# Altium project DisposeIt_Project2.PrjPcb
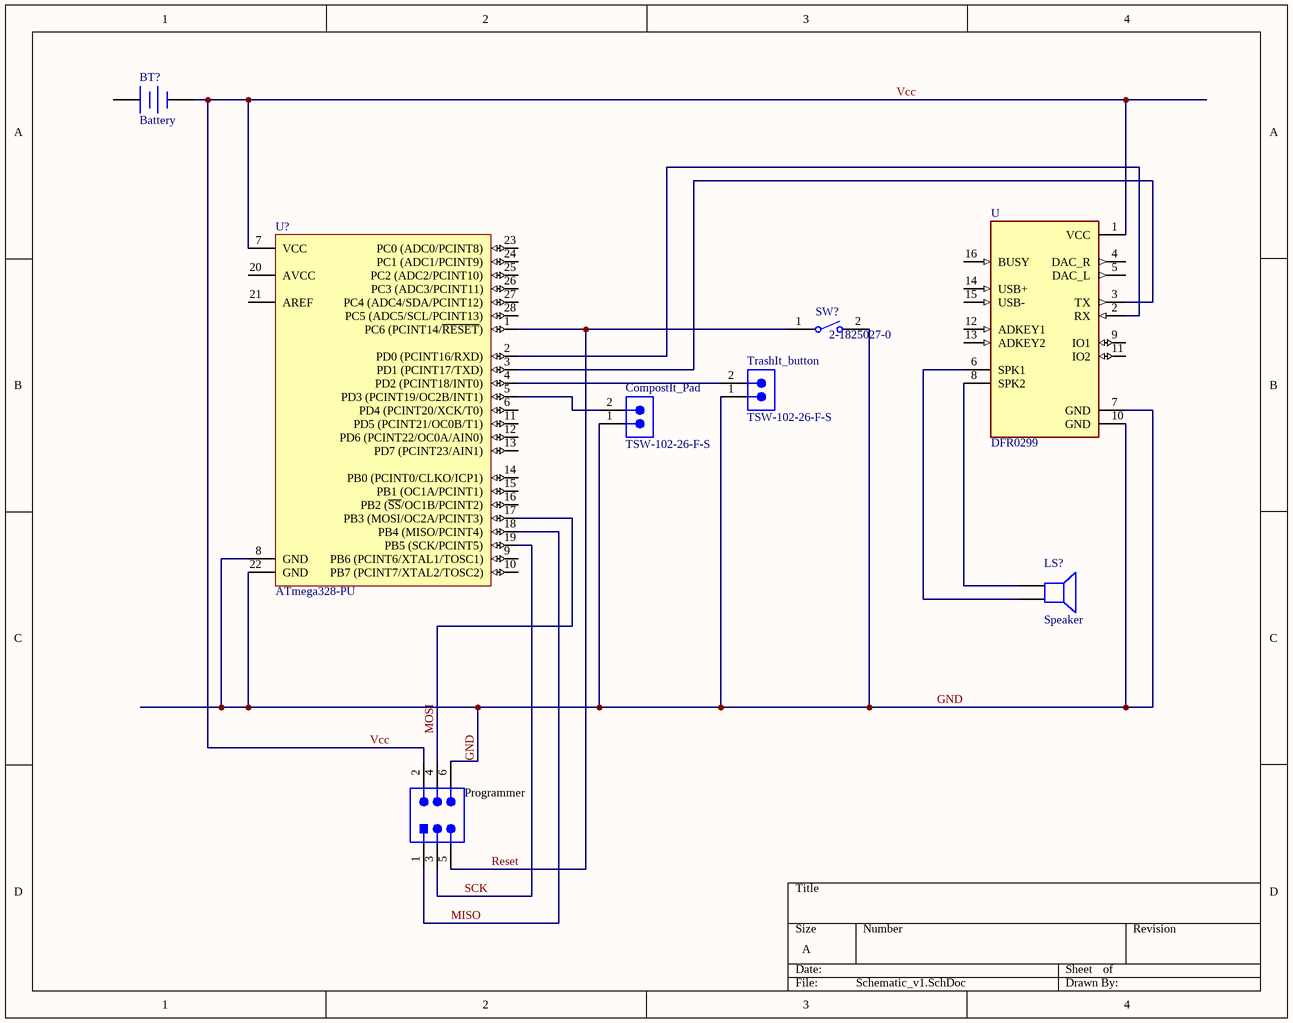
[diagram p0: Schematic_v1.SchDoc]
1 sheet, 8 parts. Net scope: global (net labels, ports and power ports of the same name join across sheets).

## Sheet Schematic_v1.SchDoc
size A; SheetNumber: 1; SheetTotal: 1

### Parts
BT?  Battery  [BAT-2]
CompostIt_Pad  TSW-102-26-F-S  [SMTC-TSW-102-26-XX-S]
LS?  Speaker  [PIN2]
Programmer  TSW-103-08-L-D  [SMTC-TSW-103-08-L-D_V]  (value not drawn)
SW?  2-1825027-0  [TECO-2-1825027-0_V]
TrashIt_button  TSW-102-26-F-S  [SMTC-TSW-102-26-XX-S]
U  DFR0299  [MODULE_DFR0299]
U?  ATmega328-PU  [28P3]

### Nets
GND: CompostIt_Pad.1 Programmer.6 SW?.2 TrashIt_button.1 U.7(GND) U.10(GND) U?.8(GND) U?.22(GND)
MISO: Programmer.1 U?.18(PB4_(MISO/PCINT4))
MOSI: Programmer.4 U?.17(PB3_(MOSI/OC2A/PCINT3))
Reset: Programmer.5 SW?.1 U?.1(PC6_(PCINT14/~{RESET}))
SCK: Programmer.3 U?.19(PB5_(SCK/PCINT5))
Vcc: BT?.2(-) Programmer.2 U.1(VCC) U?.7(VCC)
NetCompostIt_Pad_2: CompostIt_Pad.2 U?.5(PD3_(PCINT19/OC2B/INT1))
NetLS?_1: LS?.1 U.8(SPK2)
NetLS?_2: LS?.2 U.6(SPK1)
NetTrashIt_button_2: TrashIt_button.2 U?.4(PD2_(PCINT18/INT0))
NetU_2: U.2(RX) U?.2(PD0_(PCINT16/RXD))
NetU_3: U.3(TX) U?.3(PD1_(PCINT17/TXD))

Not connected (* = marked no-connect by the designer): BT? 1(+); U 4(DAC_R) 5(DAC_L) 9(IO1) 11(IO2) 12(ADKEY1) 13(ADKEY2) 14(USB+) 15(USB-) 16(BUSY); U? 6(PD4_(PCINT20/XCK/T0)) 9(PB6_(PCINT6/XTAL1/TOSC1)) 10(PB7_(PCINT7/XTAL2/TOSC2)) 11(PD5_(PCINT21/OC0B/T1)) 12(PD6_(PCINT22/OC0A/AIN0)) 13(PD7_(PCINT23/AIN1)) 14(PB0_(PCINT0/CLKO/ICP1)) 15(PB1_(OC1A/PCINT1)) 16(PB2_(~{SS}/OC1B/PCINT2)) 20(AVCC) 21(AREF) 23(PC0_(ADC0/PCINT8)) 24(PC1_(ADC1/PCINT9)) 25(PC2_(ADC2/PCINT10)) 26(PC3_(ADC3/PCINT11)) 27(PC4_(ADC4/SDA/PCINT12)) 28(PC5_(ADC5/SCL/PCINT13))

### Library data of the parts
BT? = Battery: Multicell Battery; Published: 24-Mar-1999; LatestRevisionDate: 17-Jul-2002; LatestRevisionNote: Re-released for DXP Platform.; PackageReference: BAT-2; Publisher: Altium Limited; PackageDescription: Battery; 2 Leads
CompostIt_Pad TrashIt_button = CMP-002-00072-1: .025'' SQ. TERMINAL STRIPS; Max Voltage Rating (AC): 550V; Contact Post Length: 3.2mm; Number of Positions: 2; Gender: Male; Max Current Rating: 7.6A; Pitch: 2.54mm; Voltage Rating: 500V; Packaging: Bulk; Package Quantity: 1; Length: 5.08mm; Max Operating Temperature: 125°C; Flammability Rating: UL94 V-0; Depth: 2.54mm; Radiation Hardening: No; Contact Type: -; Contact Mating Length: 5.84mm; Orientation: Vertical; Housing Color: Black; Series: TSW; Weight: 0.001257oz; Number of Rows: 1; Housing Material: Polyester; Contact Gender: Male; Termination: Through Hole; Contact Material: Bronze; Contact Plating: Gold; Number of Contacts: 2; REACH SVHC: No SVHC; RoHS Compliant: Yes; Min Operating Temperature: -55°C
LS? = Speaker: Loudspeaker; Published: 24-Mar-1999; LatestRevisionDate: 17-Jul-2002; LatestRevisionNote: Re-released for DXP Platform.; PackageReference: PIN2; Publisher: Altium Limited
Programmer = CMP-1024-00336-5: Male Header, Pitch 2.54 mm, 2 x 3 Position, Height 8.38 mm, Tail Length 5.08 mm, -55 to 125 degC, RoHS, Bulk; Manufacturer: Samtec; DatasheetVersion: 04/2012; ComponentLink3URL: http://suddendocs.samtec.com/prints/tsw-xxx-xx-x-x-xx-xxx-footprint.pdf; PackageReference: TSW-103-08-L-D; Mounting Technology: Through Hole; Min Operating Temperature: -55 degC; ComponentLink2Description: Datasheet; Lead Pitch: 2.54 mm; ComponentLink1Description: Manufacturer URL; Mount: Through Hole; ComponentLink1URL: http://www.samtec.com/; ComponentLink3Description: Package Specification; Max Operating Temperature: 125 degC; PackageDescription: Male Header, Pitch 2.54 mm, 2 x 3 Position, Height 8.38 mm, Tail Length 5.08 mm; ComponentLink2URL: https://datasheet.ciiva.com/25618/0900766b81154476-25618436.pdf; RoHSCompliant: true
SW? = CMP-2000-05529-1: Micro-Miniature Pushbutton Switch, 50 mA, -35 to 85 degC, 2-Pin THD, RoHS, Bulk; Manufacturer: TE Connectivity; Pole Throw Configuration: SPST; Body Orientation: RightAngle; Product Length (mm): 7.11mm; Voltage Rating (VDC): 24V; Current Rating (Max): 0.05A; Product Depth (mm): 10mm; Operating Force: 1.57N; Actuator Style: RoundButton; Illumination Type: NotRequired; Ground Terminal: No; Product Height (mm): 7.01mm; Actuator Color: Black; Switch Function Configuration: OFFON; Package Reference: 2-1825027-0; Terminal Type: PCPins; Contact Plating: Silver; Package Description: 2-Pin Through Hole Device, Body 15.86 x 7.11 mm, Pitch 4.5 mm; Mounting Style: ThroughHole; Manufacturer URL: http://www.te.com/; Datasheet URL: http://www.te.com/commerce/DocumentDelivery/DDEController?Action=showdoc&DocId=Customer+Drawing%7F1825027%7FG4%7Fpdf%7FEnglish%7FENG_CD_1825027_G4.pdf%7F2-1825027-0; Operating Temp Range: -35Cto85C; Packaging: TapeandReel; Datasheet Version: Rev. G4, 06/2011; Mounting Technology: ThroughHole; Contact Material: CopperAlloy; Type: Micro-Miniature
U = DFR0299: MP3 Player Audio Arduino Platform Evaluation Expansion Board; MF: DFRobot; MP: DFR0299; Availability: Unavailable; Package: None; Value: *; Price: None; SnapEDA_Link: https://www.snapeda.com/parts/DFR0299/DFRobot/view-part/588059/?ref=snap
U? = CMP-0095-00015-2: 8-bit AVR Microcontroller, 32KB Flash, 1KB EEPROM, 2KB SRAM, 28-pin PDIP, Industrial Grade (-40°C to 85°C); ComponentLink3Description: ATmega48A/48PA/88A/88PA/168A/168PA/328/328P Summary; RevisionNote: DatasheetVersion updated. URLs added.; DatasheetVersion: revD, May-2011; ComponentLink1URL: http://www.atmel.com/; PackageVersion: revB, Sep-2001; PackageDescription: 28-lead (0.300"/7.62mm Wide) Plastic Dual Inline Package (PDIP); PackageReference: 28P3; ComponentLink1Description: Manufacturer URL; ComponentLink2Description: ATmega48A/48PA/88A/88PA/168A/168PA/328/328P Datasheet; ComponentLink3URL: http://www.atmel.com/dyn/resources/prod_documents/8271S.pdf; ComponentLink2URL: http://www.atmel.com/dyn/resources/prod_documents/8271.pdf